# EAGLE schematic attiny85_LCD_rotaryenc_w_btn (EAGLE 7.7.0)
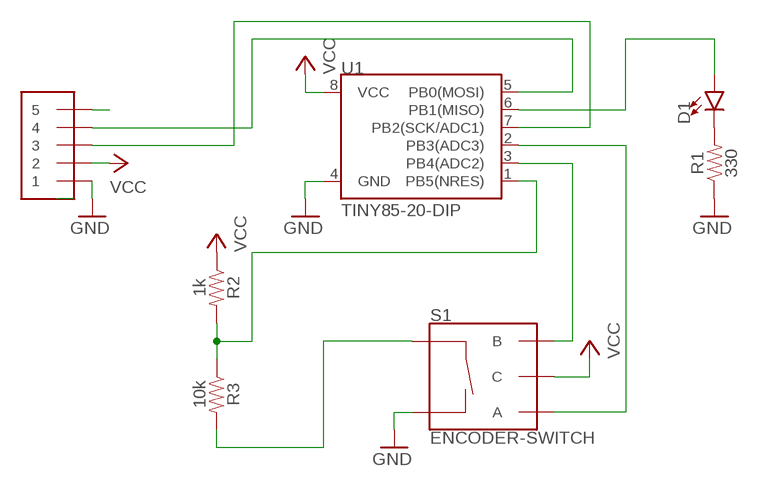
[diagram p0: schematic, sheet 1]

## Parts
D1  LED3MM  [LED_3MM]
J1  1X5  [3.5MM-5P]
R1  330  330OHM-HORIZ-1/10W-5%  [AXIAL-0.3]
R2  1k  1KOHM-HORIZ-1/4W-5%  [AXIAL-0.3]
R3  10k  10KOHM-HORIZ-1/6W-5%  [AXIAL-0.3]
S1  ENCODER-SWITCH  [ROTARY_ENC_PLAIN]
U1  TINY85-20-DIP  ATTINY45TINY85-20-DIP  [DIP08_MCU]

## Nets
GND: J1.1 R1.P$1 S1.SW- U1.4(GND)
N$1: J1.3 U1.7(PB2(SCK/ADC1))
N$2: J1.4 U1.5(PB0(MOSI))
N$3: D1.K(C) R1.P$2
N$4: D1.A U1.6(PB1(MISO))
N$5: S1.A U1.2(PB3(ADC3))
N$6: S1.B U1.3(PB4(ADC2))
N$7: R3.P$2 S1.SW+
N$8: R2.P$2 R3.P$1 U1.1(PB5(NRES))
N$9: J1.5
VCC: J1.2 R2.P$1 S1.C U1.8(VCC)

## Library data of the parts
D1 = SparkFun-LED:LED: LED (Generic) Standard schematic elements and footprints for 5mm, 3mm, 1206, and 0603 sized LEDs. Generic LEDs with no color specified.; PROD_ID: DIO-08794
J1 = adafruit:1X5
R1 = SparkFun-Resistors:330OHM: 330Ω resistor A resistor is a passive two-terminal electrical component that implements electrical resistance as a circuit element. Resistors act to reduce current flow, and, at the same time, act to lower voltage levels within circuits. - Wikipedia; PROD_ID: RES-8371
R2 = SparkFun-Resistors:1KOHM: 1kΩ resistor A resistor is a passive two-terminal electrical component that implements electrical resistance as a circuit element. Resistors act to reduce current flow, and, at the same time, act to lower voltage levels within circuits. - Wikipedia; PROD_ID: RES-08380
R3 = SparkFun-Resistors:10KOHM: 10kΩ resistor A resistor is a passive two-terminal electrical component that implements electrical resistance as a circuit element. Resistors act to reduce current flow, and, at the same time, act to lower voltage levels within circuits. - Wikipedia; PROD_ID: RES-08375
S1 = SparkFun-Switches:ENCODER-SWITCH: Rotary Encoder w/ Select Switch Encoders rotate similarly to potentiometers, but they’re different from potentiometers in that an encoder has full rotation without limits. They output gray code so that you can tell how much and in which direction the encoder has been turned. This encoder includes a push-down select switch built into the shaft. SparkFun Products Rotary Encoder <https://www.sparkfun.com/products/9117> (COM-09117); SF_SKU: COM-09117
U1 = SparkFun-Retired:ATTINY45: Atmel 8-pin 2/4/8kB flash uC Retired; PROD_ID: IC-09445